# EAGLE schematic CircularControllerSensors (EAGLE 8.0.0)
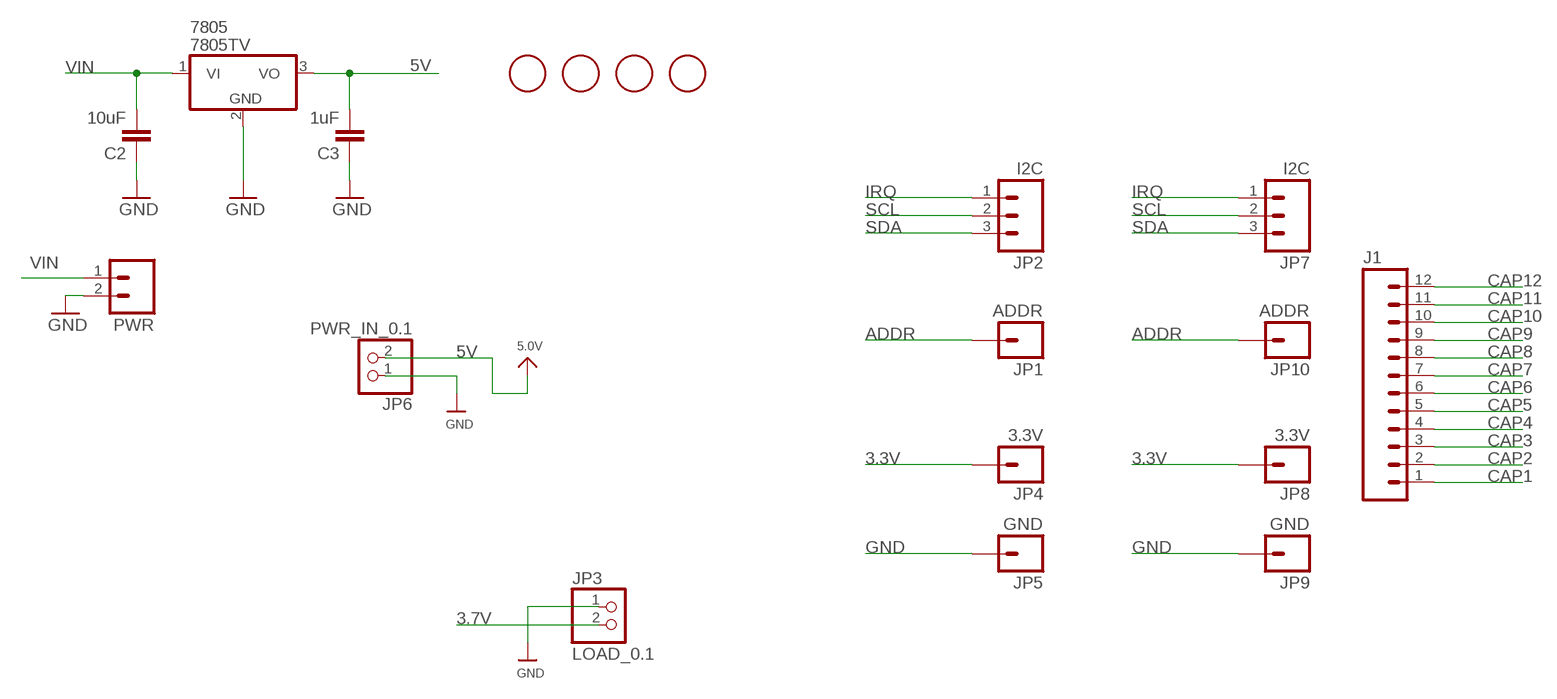
[diagram p0: schematic, sheet 1]

## Parts
7805  7805TV  [TO220V]
C2  10uF  10UF-6.3V-20%(1206)  [1206]
C3  1uF  10UF-6.3V-20%(1206)  [1206]
J1  M12PTH  [1X12]
JP1  ADDR  M01PTH  [1X01]
JP2  I2C  M03PTH  [1X03]
JP3  LOAD_0.1  HEADER-1X2  [1X02_OVAL]
JP4  3.3V  M01PTH  [1X01]
JP5  GND  M01PTH  [1X01]
JP6  PWR_IN_0.1  HEADER-1X2  [1X02_OVAL]
JP7  I2C  M03PTH  [1X03]
JP8  3.3V  M01PTH  [1X01]
JP9  GND  M01PTH  [1X01]
JP10  ADDR  M01PTH  [1X01]
PWR  M025MM  [SCREWTERMINAL-5MM-2]
U$11  MOUNTINGHOLE2.0  [MOUNTINGHOLE_2.0_PLATED]
U$16  MOUNTINGHOLE2.0  [MOUNTINGHOLE_2.0_PLATED]
U$18  MOUNTINGHOLE2.0  [MOUNTINGHOLE_2.0_PLATED]
U$19  MOUNTINGHOLE2.0  [MOUNTINGHOLE_2.0_PLATED]

## Nets
3.3V: JP4.1 JP8.1
3.7V: JP3.2
5V: 7805.3(VO) C3.2 JP6.2 ; supply symbol labelled 5.0V
ADDR: JP1.1 JP10.1
CAP1: J1.1
CAP2: J1.2
CAP3: J1.3
CAP4: J1.4
CAP5: J1.5
CAP6: J1.6
CAP7: J1.7
CAP8: J1.8
CAP9: J1.9
CAP10: J1.10
CAP11: J1.11
CAP12: J1.12
GND: 7805.2(GND) C2.1 C3.1 JP3.1 JP5.1 JP6.1 JP9.1 PWR.2
IRQ: JP2.1 JP7.1
SCL: JP2.2 JP7.2
SDA: JP2.3 JP7.3
VIN: 7805.1(VI) C2.2 PWR.1

## Library data of the parts
7805 = linear:78*: Positive VOLTAGE REGULATOR Source: http://cache.national.com/ds/LM/LM78L05.pdf http://www.fairchildsemi.com/ds/LM/LM7805.pdf
C2 = SparkFun-Capacitors:10UF-6.3V-20%(1206): CAP-10057 Ceramic; PROD_ID: CAP-10057
C3 = SparkFun-Capacitors:10UF-6.3V-20%(1206): CAP-10057 Ceramic; PROD_ID: CAP-10057; VALUE: 10uF
J1 = SparkFun-Connectors:M12: Header 12 Standard 12-pin 0.1" header. Use with straight break away headers (SKU : PRT-00116), right angle break away headers (PRT-00553), swiss pins (PRT-00743), machine pins (PRT-00117), and female headers (PRT-00115).
JP1 JP4 JP5 JP8-JP10 = SparkFun:M01: Header 1 Standard 1-pin 0.1" header. Use with straight break away headers (SKU : PRT-00116), right angle break away headers (PRT-00553), swiss pins (PRT-00743), machine pins (PRT-00117), and female headers (PRT-00115).
JP2 JP7 = SparkFun:M03: Header 3 Standard 3-pin 0.1" header. Use with straight break away headers (SKU : PRT-00116), right angle break away headers (PRT-00553), swiss pins (PRT-00743), machine pins (PRT-00117), and female headers (PRT-00115). Molex polarized connector foot print use with SKU : PRT-08232 with associated crimp pins and housings.
JP3 JP6 = microbuilder:HEADER-1X2: PIN HEADER
PWR = SparkFun-Connectors:M02: Standard 2-pin 0.1" header. Use with - straight break away headers ( PRT-00116) - right angle break away headers (PRT-00553) - swiss pins (PRT-00743) - machine pins (PRT-00117) - female headers (PRT-00115) Molex polarized connector foot print use with: PRT-08233 with associated crimp pins and housings. 2.54_SCREWTERM for use with PRT-10571. 3.5mm Screw Terminal footprints for PRT-08084 5mm Screw Terminal footprints for use with PRT-08432; STOREFRONT_ID: PRT-08432
U$11 U$16 U$18 U$19 = microbuilder:MOUNTINGHOLE: Mounting Hole

## Net classes
0 default: width 0.203 mm